# Altium schematic sheet connections.SchDoc
size A4
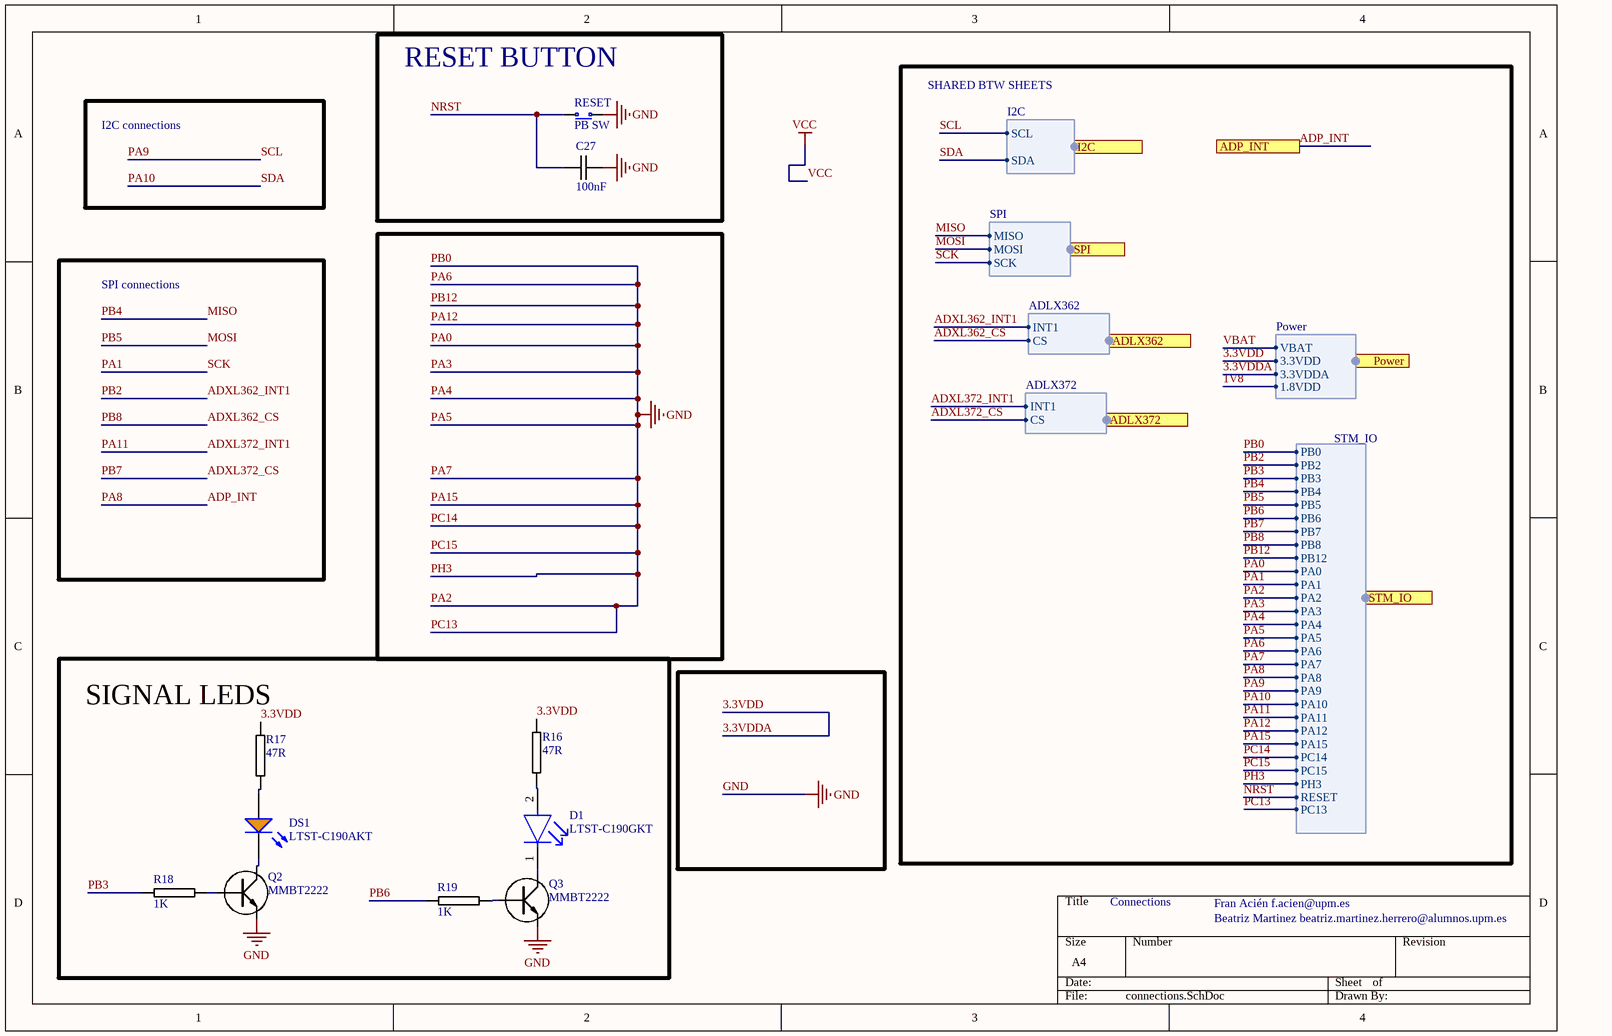
[diagram p0: connections.SchDoc]

## Parts
C27  100nF  [0603C-GENERIC]
D1  LTST-C190GKT  [FP-LTST-C190GKT-MFG]
DS1  LTST-C190AKT  [LTST-C190AKT-2_V]
Q2  MMBT2222  [SOT23-BCE]
Q3  MMBT2222  [SOT23-BCE]
R16  47R  [0603R-47]
R17  47R  [0603R-47]
R18  1K  [0603R-1k]
R19  1K  [0603R-1k]
RESET  PB SW  [Switch-PB-6.2x6.3mm-SMD]

## Blocks framed on the sheet
RESET BUTTON: C27 RESET
SIGNAL LEDS: D1 DS1 Q2 Q3 R16-R19

## Ports
ADLX362 (harness ADLX362), ADLX372 (harness ADLX372), ADP_INT, I2C (harness I2C), Power (harness Power), SPI (harness SPI), STM_IO (harness STM_IO)

## Harnesses
Power: VBAT, 3.3VDD, 3.3VDDA, 1.8VDD
SPI: MISO, MOSI, SCK
I2C: SCL, SDA
STM_IO: PB2, PB3, PB4, PB5, PB6, PB7, PB8, PB12, PA0, PA1, PA2, PA3, PA4, PA5, PA6, PA7, PA8, PA9, PA10, PA11, PA12, PA15, PC14, PC15, PB0, PH3, RESET, PC13
ADLX372: INT1, CS
ADLX362: INT1, CS

## Nets
GND: C27.2 Q2.E Q3.E RESET.2(COM) ; port STM_IO.PB12, port STM_IO.PA0, port STM_IO.PA2, port STM_IO.PA3, port STM_IO.PA4, port STM_IO.PA5, port STM_IO.PA6, port STM_IO.PA7, port STM_IO.PA12, port STM_IO.PA15, port STM_IO.PC14, port STM_IO.PC15, port STM_IO.PB0, port STM_IO.PH3, port STM_IO.PC13  [also labelled PA0, PA12, PA15, PA2, PA3, PA4, PA5, PA6, PA7, PB0, PB12, PC13, PC14, PC15, PH3]
1V8: port Power.1.8VDD
3.3VDD: R16.1 R17.2 ; port Power.3.3VDD, port Power.3.3VDDA  [also labelled 3.3VDDA]
ADP_INT: port ADP_INT, port STM_IO.PA8  [also labelled PA8]
ADXL362_CS: port STM_IO.PB8, port ADLX362.CS  [also labelled PB8]
ADXL362_INT1: port STM_IO.PB2, port ADLX362.INT1  [also labelled PB2]
ADXL372_CS: port STM_IO.PB7, port ADLX372.CS  [also labelled PB7]
ADXL372_INT1: port STM_IO.PA11, port ADLX372.INT1  [also labelled PA11]
MISO: port SPI.MISO, port STM_IO.PB4  [also labelled PB4]
MOSI: port SPI.MOSI, port STM_IO.PB5  [also labelled PB5]
NRST: C27.1 RESET.1(N.O) ; port STM_IO.RESET
PA1: port SPI.SCK, port STM_IO.PA1  [also labelled SCK]
PA9: port I2C.SCL, port STM_IO.PA9  [also labelled SCL]
PA10: port I2C.SDA, port STM_IO.PA10  [also labelled SDA]
PB3: R18.1 ; port STM_IO.PB3
PB6: R19.1 ; port STM_IO.PB6
VBAT: port Power.VBAT
NetD1_1: D1.1(C) Q3.C
NetD1_2: D1.2(A) R16.2
NetDS1_1: DS1.1(A) R17.1
NetDS1_2: DS1.2(K) Q2.C
NetQ2_B: Q2.B R18.2
NetQ3_B: Q3.B R19.2

## Notes on the sheet
- SHARED BTW SHEETS
- I2C connections
- SPI connections
- Connections
- Fran Acién f.acien@upm.es
- Beatriz Martinez beatriz.martinez.herrero@alumnos.upm.es

## Library data of the parts
C27 = 0603C-100NF-50V-X7R-TDK: CAPACITOR 0603 CERAMIC; Manufacturer Part Number: C1608X7R1H103K; Manufacturer: TDK Corporation; Temperature Coefficient: X7R; Tolerance: ±10%; Voltage - Rated: 50V; Capacitance: 10000pF; Reel: C68; RoHS: RoHS Compliant; Lead Spacing: -; Package / Case: 0603 (1608 metric); Features: General Purpose; Packaging: Tape & Reel (TR); Thickness: 0.80mm; Operating Temperature: -55°C ~ 125°C; Mounting Type: Surface Mount, MLCC; Category: Capacitors; Supplier 1: Digi-Key; Supplier Part Number 1: 445-1314-2-ND
D1 = CMP-22017-000005-1: LED GREEN CLEAR CHIP SMD; Reverse Voltage: 5V; Power Dissipation: 100mW; Forward Voltage: 2.1V; Test Current: 10mA; Number of LEDs: 1; Viewing Angle: 130°; Forward Current: 30mA; Voltage: 2V; Wavelength: 565nm; Dominant Wavelength: 569nm; Luminous Intensity: 6mcd; Lens Color: Colorless; Packaging: Tape and Reel; Lens Transparency: Clear; Min Operating Temperature: -55°C; Case Code (Metric): 1608; Lens Style: Clear; Case/Package: 0603; Mount: Surface Mount; Package Quantity: 1; Height: 0.8mm; Illumination Color: Green; Radiation Hardening: No; Depth: 0.8mm; Number of Pins: 2; Max Operating Temperature: 85°C; Color: Green; Number of Elements: 1; Power Rating: 100mW; Case Code (Imperial): 0603; Width: 0.8mm; Length: 1.6mm; Lead Free: Lead Free
DS1 = CMP-1674-00006-1: Single Color Chip LED, 2.1 V, 2 mcd, -55 to 85 degC, 2-Pin SMD, RoHS, Tape and Reel; PackageDescription: 2-Pin Surface Mount Device, Body 1.6 x 0.8 mm; ComponentLink1URL: http://www.us.liteon.com/; ComponentLink1Description: Manufacturer URL; PackageReference: LTST-C190AKT-2; ComponentLink2Description: Datasheet; DatasheetVersion: Jan-03; ComponentLink2URL: http://datasheet.octopart.com/LTST-C190AKT-Lite-On-datasheet-11729267.pdf
Q2 Q3 = MMBT2222: BC847 SMALL SIGNAL NPN TRANSISTOR; Supplier 1: Digi-Key; Supplier Part Number 1: MMBT2222A-FDICT-ND
R16 R17 = 0603R-47R: GENERIC RESISTOR 0603; Manufacturer Part Number: RMC 1/16 47 1% R; Manufacturer: Stackpole Electronics Inc; Power (Watts): 0.1W, 1/10W; Temperature Coefficient: ±100ppm/°C; Resistance In Ohms: 47.0; Tolerance: ±1%; Supplier 1: Digi-Key; Supplier Part Number 1: RMC1/1647FR-ND; Supplier Part Number: RMC1/1647FR-ND; Category: Resistors; Case: 0603 (1608 metric); Packaging: Tape & Reel (TR); Lead Style: Surface Mount (SMD - SMT); RoHS: RoHS Compliant; Supplier: Digi-Key; Composition: Thick Film
R18 R19 = 0603R-1K: GENERIC RESISTOR 0603; Manufacturer Part Number: RMCF 1/16 1K 1% R; Manufacturer: Stackpole Electronics Inc; Reel: R14; Supplier 1: Digi-Key; Supplier Part Number 1: RMCF0603FT1K00TR-ND
RESET = TS604VM1-025BR-R: Tactile Switch, SPNO, SMD, 160gf, 6.2x6.3x2.5mm; Manufacturer: Dailywell; Part number IPS: 00000007812; Artikkelnr Noca: 50019106; Part Number: Switch-PB-6.2x6.3mm-SMD; Manufacturer Part Number: TS604VM1-025BR-R; Footprint Doc: Switch-PB-6.2x6.3mm-SMD; LatestRevisionDate: 2016-04-21; Pin Count: 4; Publisher: Nordic Semiconductor; Published: 2010-02-01; Value: PB SW; Note: *; ComponentLink1URL: *; ComponentLink1Description: Datasheet; ComponentLink2URL: *; ComponentLink2Description: Supplier link; HelpURL: \\hizz\pro\app9717\Datasheet\switches\Dailywell\TS604VM1-025BR-R.pdf; Supplier 1: Cabcon; Supplier Part Number 1: TS604VM1-025BR-R; Supplier 2: Mouser; Supplier Part Number 2: 688-SKHUALE010